# Altium schematic sheet PowerPath.SchDoc
size Tabloid
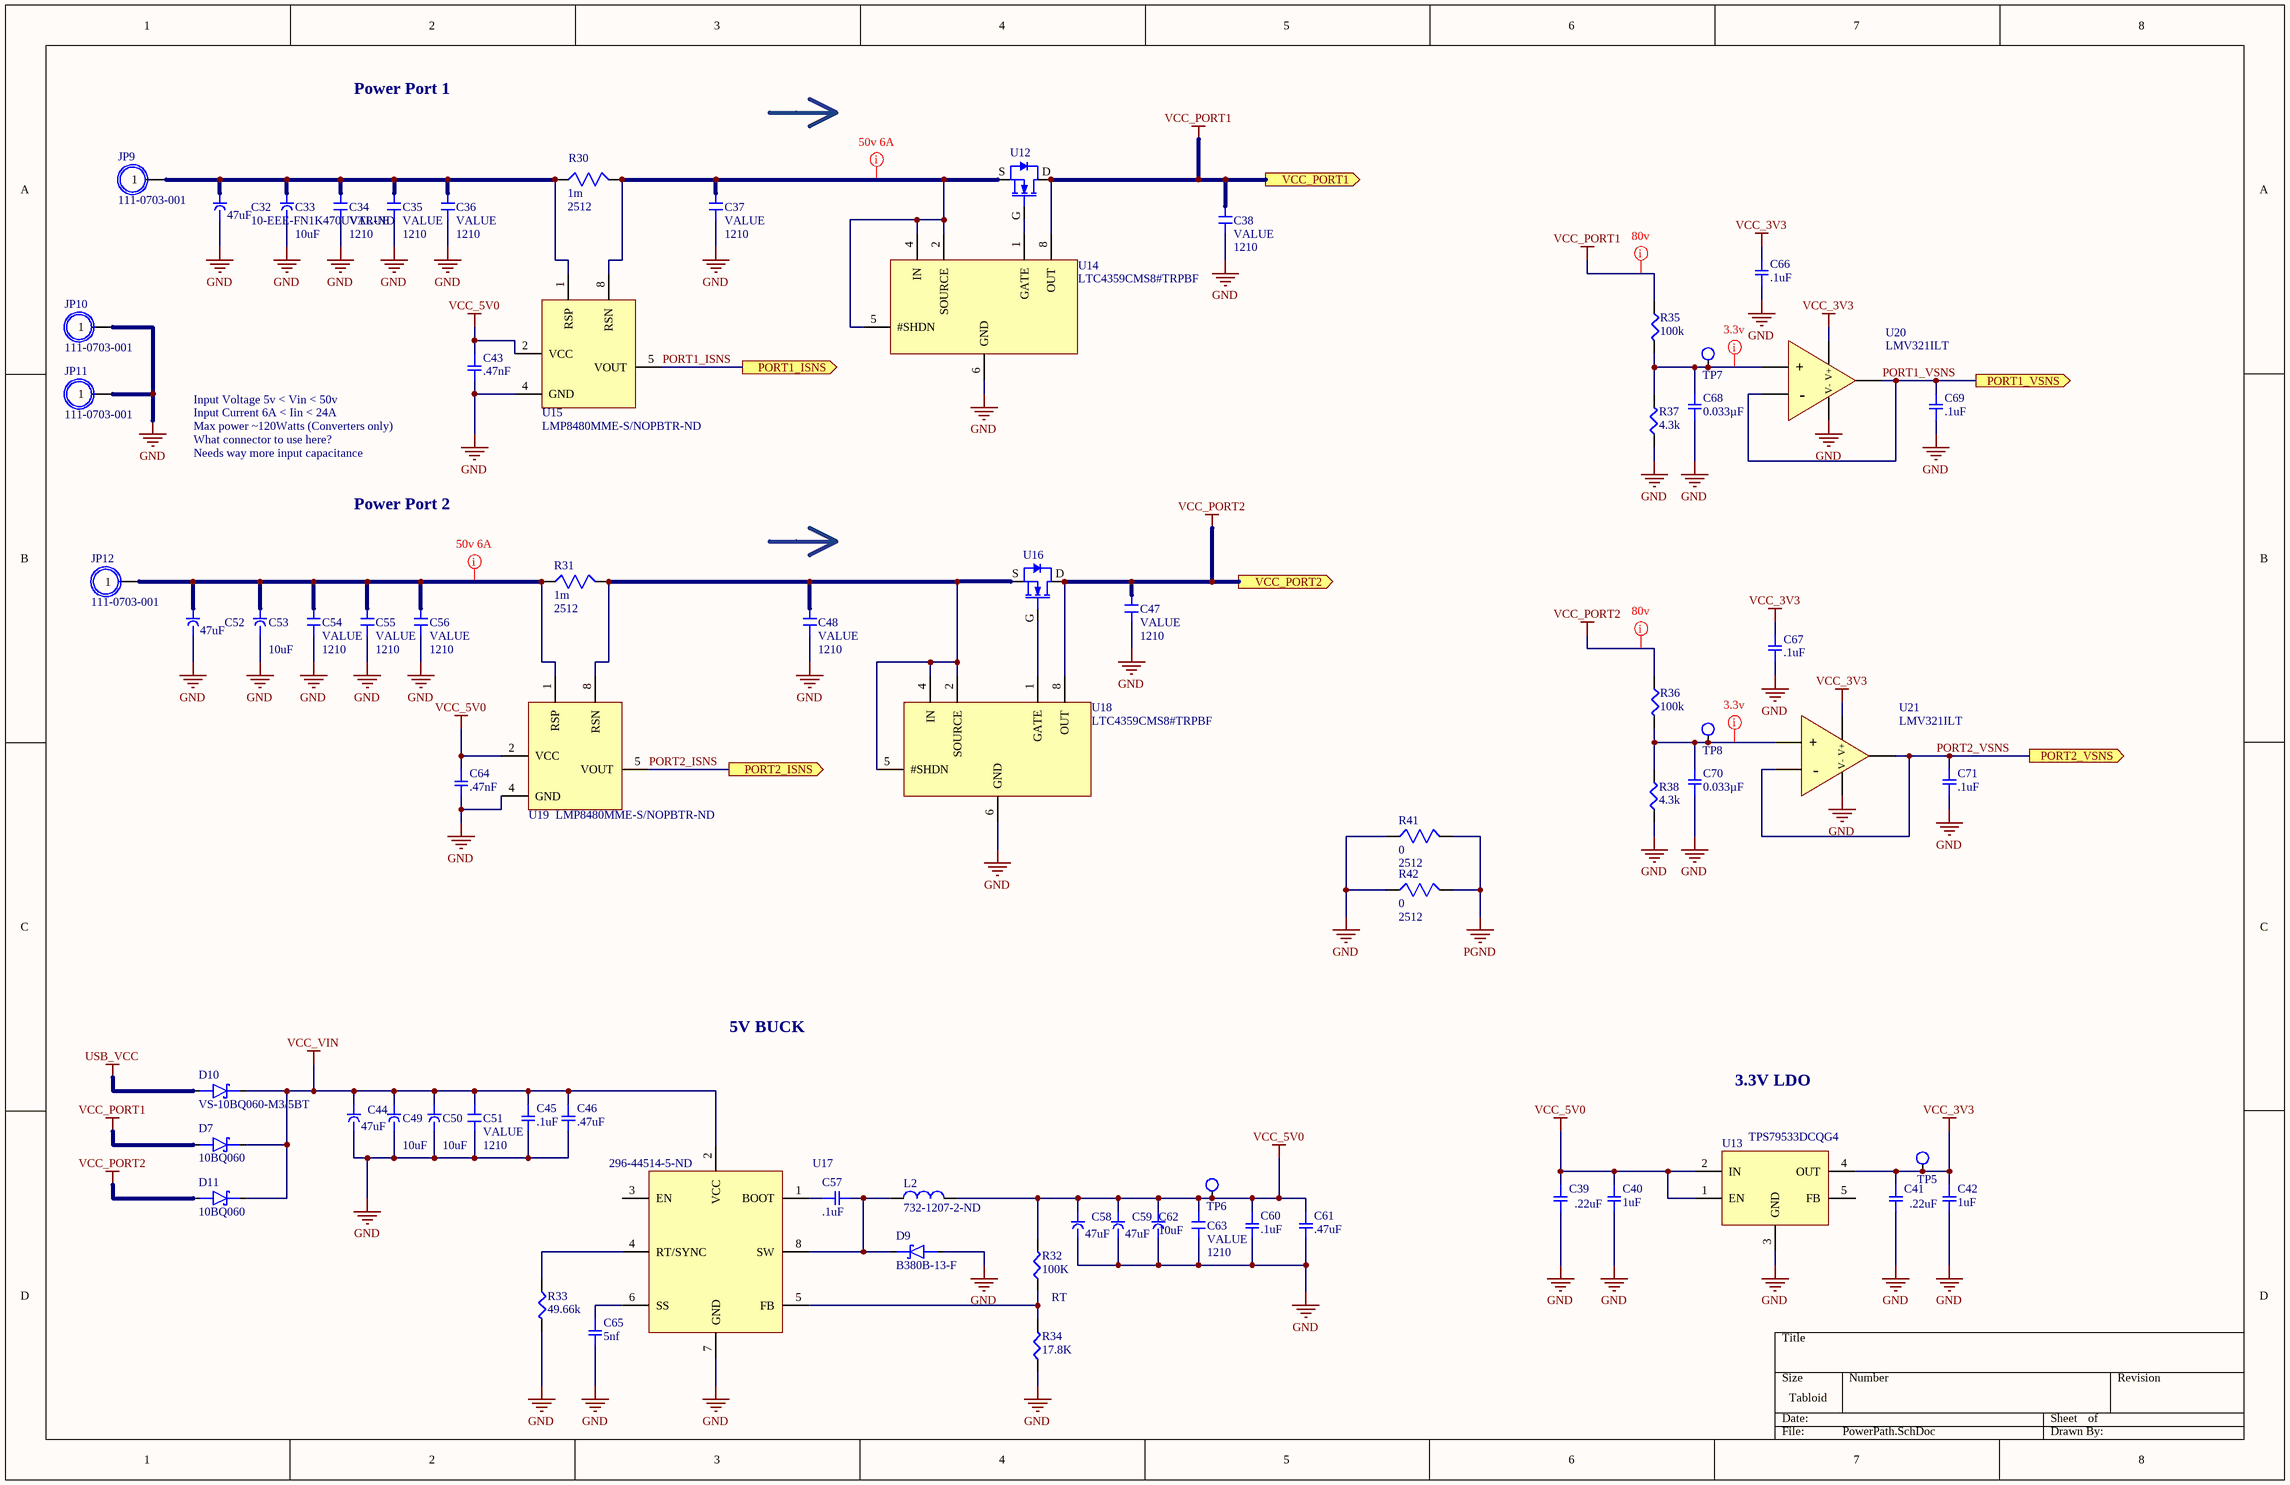
[diagram p0: PowerPath.SchDoc]

## Parts
C32  10-EEE-FN1K470UVTR-ND  [EEE-FN1K470UV]
C33  value 10uF  [panasonic d8]  (hidden comment: EEE-FN1K100XL)
C34  VALUE  Size: 1210  [1210 cap]
C35  VALUE  Size: 1210  [1210 cap]
C36  VALUE  Size: 1210  [1210 cap]
C37  VALUE  Size: 1210  [1210 cap]
C38  VALUE  Size: 1210  [1210 cap]
C39  .22uF  [SMD-0603C]
C40  1uF  [SMD-0603C]
C41  .22uF  [SMD-0603C]
C42  1uF  [SMD-0603C]
C43  .47nF  [SMD-0603C]
C44  10-EEE-FN1K470UVTR-ND  [EEE-FN1K470UV]  (value not drawn)
C45  .1uF  [SMD-0805C]
C46  .47uF  [SMD-0805C]
C47  VALUE  Size: 1210  [1210 cap]
C48  VALUE  Size: 1210  [1210 cap]
C49  value 10uF  [panasonic d8]  (hidden comment: EEE-FN1K100XL)
C50  value 10uF  [panasonic d8]  (hidden comment: EEE-FN1K100XL)
C51  VALUE  Size: 1210  [1210 cap]
C52  10-EEE-FN1K470UVTR-ND  [EEE-FN1K470UV]  (value not drawn)
C53  value 10uF  [panasonic d8]  (hidden comment: EEE-FN1K100XL)
C54  VALUE  Size: 1210  [1210 cap]
C55  VALUE  Size: 1210  [1210 cap]
C56  VALUE  Size: 1210  [1210 cap]
C57  .1uF  [SMD-0805C]
C58  10-EEE-FN1K470UVTR-ND  [EEE-FN1K470UV]  (value not drawn)
C59  10-EEE-FN1K470UVTR-ND  [EEE-FN1K470UV]  (value not drawn)
C60  .1uF  [SMD-0805C]
C61  .47uF  [SMD-0805C]
C62  value 10uF  [panasonic d8]  (hidden comment: EEE-FN1K100XL)
C63  VALUE  Size: 1210  [1210 cap]
C64  .47nF  [SMD-0603C]
C65  5nf  [SMD-0603C]
C66  .1uF  [SMD-0603C]
C67  .1uF  [SMD-0603C]
C68  0.033µF  [SMD-0603C]
C69  .1uF  [SMD-0603C]
C70  0.033µF  [SMD-0603C]
C71  .1uF  [SMD-0603C]
D7  10BQ060  [DO-214AA/SMB]
D9  B380B-13-F  [DO-214AA/SMB]
D10  VS-10BQ060-M3/5BT  [DO-214AA/SMB]
D11  10BQ060  [DO-214AA/SMB]
JP9  111-0703-001  [Banana Jack Post]
JP10  111-0703-001  [Banana Jack Post]
JP11  111-0703-001  [Banana Jack Post]
JP12  111-0703-001  [Banana Jack Post]
L2  732-1207-2-ND  [8R2]
R30  1m  [2512]
R31  1m  [2512]
R32  100K  [SMD-0603-RES]
R33  49.66k  [SMD-0603-RES]
R34  17.8K  [SMD-0603-RES]
R35  100k  [SMD-0805-RES]
R36  100k  [SMD-0805-RES]
R37  4.3k  [SMD-0603-RES]
R38  4.3k  [SMD-0603-RES]
R41  0  [2512]
R42  0  [2512]
TP5  TEST POINT 1MM  [TEST POINT]  (value not drawn)
TP6  TEST POINT 1MM  [TEST POINT]  (value not drawn)
TP7  TEST POINT 1MM  [TEST POINT]  (value not drawn)
TP8  TEST POINT 1MM  [TEST POINT]  (value not drawn)
U12  SQJA80EP-T1_GE3TR-ND  [PowerPAK® SO-8L SINGLE]  (value not drawn)
U13  TPS79533DCQG4  [6 pin sot223]
U14  LTC4359CMS8#TRPBF  [8-MSOP]
U15  LMP8480MME-S/NOPBTR-ND  [DGK(S-PDSO-G8)]
U16  SQJA80EP-T1_GE3TR-ND  [PowerPAK® SO-8L SINGLE]  (value not drawn)
U17  296-44514-5-ND  [DDA R-PDSO-G8]
U18  LTC4359CMS8#TRPBF  [8-MSOP]
U19  LMP8480MME-S/NOPBTR-ND  [DGK(S-PDSO-G8)]
U20  LMV321ILT  [SOT-23-5]
U21  LMV321ILT  [SOT-23-5]

## Ports
PORT1_ISNS (out), PORT1_VSNS (out), PORT2_ISNS (out), PORT2_VSNS (out), VCC_PORT1 (out), VCC_PORT2 (out)

## Nets
GND: C32.1 C33.2 C34.2 C35.2 C36.2 C37.2 C38.2 C39.2 C40.2 C41.2 C42.2 C43.2 C44.1 C45.2 C46.2 C47.2 C48.2 C49.2 C50.2 C51.2 C52.1 C53.2 C54.2 C55.2 C56.2 C58.1 C59.1 C60.2 C61.2 C62.2 C63.2 C64.2 C65.2 C66.1 C67.1 C68.1 C69.1 C70.1 C71.1 D9.2 JP10.1 JP11.1 R33.2 R34.1 R37.1 R38.1 R41.1 R42.1 U13.3(GND) U14.6(GND) U15.4(GND) U17.7(GND) U18.6(GND) U19.4(GND) U20.2(V-) U21.2(V-)
PGND: R41.2 R42.2
USB_VCC: D10.2
VCC_3V3: C41.1 C42.1 C66.2 C67.2 TP5.1 U13.4(OUT) U20.5(V+) U21.5(V+)
VCC_5V0: C39.1 C40.1 C43.1 C58.2 C59.2 C60.1 C61.1 C62.1 C63.1 C64.1 L2.2 R32.2 TP6.1 U13.1(EN) U13.2(IN) U15.2(VCC) U19.2(VCC)
VCC_PORT1: C38.1 D7.2 R35.1 U12.D(DRAIN) U14.8(OUT) ; port VCC_PORT1
VCC_PORT2: C47.1 D11.2 R36.1 U16.D(DRAIN) U18.8(OUT) ; port VCC_PORT2
VCC_VIN: C44.2 C45.1 C46.1 C49.1 C50.1 C51.1 D7.1 D10.1 D11.1 U17.2(VCC)
PORT1_ISNS: U15.5(VOUT) ; port PORT1_ISNS
PORT1_VSNS: C69.2 U20.3(-) U20.4(OUT) ; port PORT1_VSNS
PORT2_ISNS: U19.5(VOUT) ; port PORT2_ISNS
PORT2_VSNS: C71.2 U21.3(-) U21.4(OUT) ; port PORT2_VSNS
NetC32_2: C32.2 C33.1 C34.1 C35.1 C36.1 JP9.1 R30.1 U15.1(RSP)
NetC37_1: C37.1 R30.2 U12.S(SOURCE) U14.2(SOURCE) U14.4(IN) U14.5(#SHDN) U15.8(RSN)
NetC48_1: C48.1 R31.2 U16.S(SOURCE) U18.2(SOURCE) U18.4(IN) U18.5(#SHDN) U19.8(RSN)
NetC52_2: C52.2 C53.1 C54.1 C55.1 C56.1 JP12.1 R31.1 U19.1(RSP)
NetC57_1: C57.1 U17.1(BOOT)
NetC57_2: C57.2 D9.1 L2.1 U17.8(SW)
NetC65_1: C65.1 U17.6(SS)
NetC68_2: C68.2 R35.2 R37.2 TP7.1 U20.1(+)
NetC70_2: C70.2 R36.2 R38.2 TP8.1 U21.1(+)
NetR32_1: R32.1 R34.2 U17.5(FB)
NetR33_1: R33.1 U17.4(RT/SYNC)
NetU12_G: U12.G(GATE) U14.1(GATE)
NetU16_G: U16.G(GATE) U18.1(GATE)

Not connected (* = marked no-connect by the designer): U13 5(FB); U17 3(EN)

## Layout directives
mark named 50v 6A: NetC37_1, NetC52_2
mark named 80v: VCC_PORT1, VCC_PORT2
mark named 3.3v: NetC68_2, NetC70_2

## Notes on the sheet
- Power Port 1
- Input Voltage 5v < Vin < 50v
- Input Current 6A < Iin < 24A
- Max power ~120Watts (Converters only)
- What connector to use here?
- Needs way more input capacitance
- Power Port 2
- 5V BUCK
- 3.3V LDO
- RT
- (in symbol CAP ALUM 47UF) 47uF

## Library data of the parts
C32 C44 C52 C58 C59 = CAP ALUM 47UF: CAP ALUM 47UF 20% 80V SMD
C33 C49 C50 C53 C62 = CAP ALUM 10UF: CAP ALUM 10UF 20% 80V SMD
C34-C38 C47 C48 C51 C54-C56 C63 = CAP SMD 1210
C39-C42 = GCJ188R71E224KA12D: CAP CER 0.22UF 25V X7R 0603; Manufacturer: Murata Electronics North America; Factory Stock: 0; Unit Price (USD): 0.24; Minimum Quantity: 1; Value: 0.22µF; Tolerance: ±10%; Datasheets: http://www.murata.com/~/media/webrenewal/support/library/catalog/products/capacitor/mlcc/c03e.ashx; Image: //media.digikey.com/Renders/Murata%20Renders/0603%28LQG18%29.jpg; Digi-Key Part Number: 490-5797-1-ND; Part Number: GCJ188R71E224KA12D; Quantity Available: 23903; @ qty: 0; Packaging: Cut Tape (CT); Series: GCJ; Part Status: Active; Voltage: 25V; Temperature Coefficient: X7R; Operating Temperature: -55°C ~ 125°C; Features: Soft Termination; Ratings: AEC-Q200; Applications: Automotive, Boardflex Sensitive; Mounting Type: Surface Mount, MLCC; Package / Case: 0603 (1608 Metric); Size / Dimension: 0.063" L x 0.031" W (1.60mm x 0.80mm); Height - Seated (Max): -; Thickness (Max): 0.035" (0.90mm); Lead Spacing: -; Lead Style: -
C43 C64 = GCJ188R71H222KA01D: CAP CER 2200PF 50V X7R 0603; Manufacturer: Murata Electronics North America; Factory Stock: 0; Unit Price (USD): 0.16; Minimum Quantity: 1; Tolerance: ±10%; Datasheets: http://www.murata.com/~/media/webrenewal/support/library/catalog/products/capacitor/mlcc/c03e.ashx; Image: //media.digikey.com/Renders/Murata%20Renders/0603%28LQG18%29.jpg; Digi-Key Part Number: 490-5766-1-ND; Part Number: GCJ188R71H222KA01D; Quantity Available: 34786; @ qty: 0; Packaging: Cut Tape (CT); Series: GCJ; Part Status: Active; Value: 2200pF; Voltage: 50V; Temperature Coefficient: X7R; Operating Temperature: -55°C ~ 125°C; Features: Soft Termination; Ratings: AEC-Q200; Applications: Automotive, Boardflex Sensitive; Mounting Type: Surface Mount, MLCC; Package / Case: 0603 (1608 Metric); Size / Dimension: 0.063" L x 0.031" W (1.60mm x 0.80mm); Height - Seated (Max): -; Thickness (Max): 0.031" (0.80mm); Lead Spacing: -; Lead Style: -
C45 C46 C60 C61 = GRM2195C1H123FA01D: CAP CER 0.012UF 50V NP0 0805; Manufacturer: Murata Electronics North America; Factory Stock: 0; Unit Price (USD): 0.91; Minimum Quantity: 1; Value: 0.012µF; Tolerance: ±1%; Temperature Coefficient: C0G, NP0; Datasheets: http://www.murata.com/~/media/webrenewal/support/library/catalog/products/capacitor/mlcc/c02e.pdf; Image: //media.digikey.com/Renders/Murata%20Renders/0805%20(2012%20Metric)%20.85mm.jpg; Digi-Key Part Number: 490-12608-1-ND; Part Number: GRM2195C1H123FA01D; Quantity Available: 4905; @ qty: 0; Packaging: Cut Tape (CT); Series: GRM; Part Status: Active; Voltage: 50V; Operating Temperature: -55°C ~ 125°C; Features: -; Ratings: -; Applications: General Purpose; Mounting Type: Surface Mount, MLCC; Package / Case: 0805 (2012 Metric); Size / Dimension: 0.079" L x 0.049" W (2.00mm x 1.25mm); Height - Seated (Max): -; Thickness (Max): 0.037" (0.95mm); Lead Spacing: -; Lead Style: -
C57 = GRM2195C1H153GA01D: CAP CER 0.015UF 50V NP0 0805; Manufacturer: Murata Electronics North America; Factory Stock: 0; Unit Price (USD): 0.72; Minimum Quantity: 1; Value: 0.015µF; Tolerance: ±2%; Temperature Coefficient: C0G, NP0; Datasheets: http://www.murata.com/~/media/webrenewal/support/library/catalog/products/capacitor/mlcc/c02e.pdf; Image: //media.digikey.com/Renders/Murata%20Renders/0805%20(2012%20Metric)%20.85mm.jpg; Digi-Key Part Number: 490-11581-1-ND; Part Number: GRM2195C1H153GA01D; Quantity Available: 3423; @ qty: 0; Packaging: Cut Tape (CT); Series: GRM; Part Status: Active; Voltage: 50V; Operating Temperature: -55°C ~ 125°C; Features: -; Ratings: -; Applications: General Purpose; Mounting Type: Surface Mount, MLCC; Package / Case: 0805 (2012 Metric); Size / Dimension: 0.079" L x 0.049" W (2.00mm x 1.25mm); Height - Seated (Max): -; Thickness (Max): 0.037" (0.95mm); Lead Spacing: -; Lead Style: -
C65 = GCJ188R72A103KA01D: CAP CER 10000PF 100V X7R 0603; Manufacturer: Murata Electronics North America; Factory Stock: 0; Unit Price (USD): 0.21; Minimum Quantity: 1; Tolerance: ±10%; Datasheets: http://www.murata.com/~/media/webrenewal/support/library/catalog/products/capacitor/mlcc/c03e.ashx; Image: //media.digikey.com/Renders/Murata%20Renders/0603%28LQG18%29.jpg; Digi-Key Part Number: 490-5771-1-ND; Part Number: GCJ188R72A103KA01D; Quantity Available: 130287; @ qty: 0; Packaging: Cut Tape (CT); Series: GCJ; Part Status: Active; Value: 10000pF; Voltage: 100V; Temperature Coefficient: X7R; Operating Temperature: -55°C ~ 125°C; Features: Soft Termination; Ratings: AEC-Q200; Applications: Automotive, Boardflex Sensitive; Mounting Type: Surface Mount, MLCC; Package / Case: 0603 (1608 Metric); Size / Dimension: 0.063" L x 0.031" W (1.60mm x 0.80mm); Height - Seated (Max): -; Thickness (Max): 0.031" (0.80mm); Lead Spacing: -; Lead Style: -
C66 C67 C69 C71 = GCJ188R71H333KA12D: CAP CER 0.033UF 50V X7R 0603; Manufacturer: Murata Electronics North America; Factory Stock: 0; Unit Price (USD): 0.23; Minimum Quantity: 1; Value: 0.033µF; Tolerance: ±10%; Datasheets: http://www.murata.com/~/media/webrenewal/support/library/catalog/products/capacitor/mlcc/c03e.ashx; Image: //media.digikey.com/Renders/Murata%20Renders/0603%28LQG18%29.jpg; Digi-Key Part Number: 490-5852-1-ND; Part Number: GCJ188R71H333KA12D; Quantity Available: 16459; @ qty: 0; Packaging: Cut Tape (CT); Series: GCJ; Part Status: Active; Voltage: 50V; Temperature Coefficient: X7R; Operating Temperature: -55°C ~ 125°C; Features: Soft Termination; Ratings: AEC-Q200; Applications: Automotive, Boardflex Sensitive; Mounting Type: Surface Mount, MLCC; Package / Case: 0603 (1608 Metric); Size / Dimension: 0.063" L x 0.031" W (1.60mm x 0.80mm); Height - Seated (Max): -; Thickness (Max): 0.031" (0.80mm); Lead Spacing: -; Lead Style: -
C68 C70 = GCJ188R71H333KA12D: CAP CER 0.033UF 50V X7R 0603; Manufacturer: Murata Electronics North America; Factory Stock: 0; Unit Price (USD): 0.23; Minimum Quantity: 1; Tolerance: ±10%; Datasheets: http://www.murata.com/~/media/webrenewal/support/library/catalog/products/capacitor/mlcc/c03e.ashx; Image: //media.digikey.com/Renders/Murata%20Renders/0603%28LQG18%29.jpg; Digi-Key Part Number: 490-5852-1-ND; Part Number: GCJ188R71H333KA12D; Quantity Available: 16459; @ qty: 0; Packaging: Cut Tape (CT); Series: GCJ; Part Status: Active; Value: 0.033µF; Voltage: 50V; Temperature Coefficient: X7R; Operating Temperature: -55°C ~ 125°C; Features: Soft Termination; Ratings: AEC-Q200; Applications: Automotive, Boardflex Sensitive; Mounting Type: Surface Mount, MLCC; Package / Case: 0603 (1608 Metric); Size / Dimension: 0.063" L x 0.031" W (1.60mm x 0.80mm); Height - Seated (Max): -; Thickness (Max): 0.031" (0.80mm); Lead Spacing: -; Lead Style: -
D7 D11 = DIODE 10BQ060: DIODE SCHOTTKY 60V 1A SMB / Diode Schottky 60 V 1A Surface Mount DO-214AA (SMB) / https://assets.nexperia.com/documents/package-information/SOT669.pdf
D9 = DIODE B380B-13-F: DIODE SCHOTTKY 80V 3A SMB
D10 = DIODE 10BQ060: DIODE SCHOTTKY 60V 1A SMB
JP9-JP12 = CONN BANANA JACK: CONN BIND POST KNURLED BLACK‎
L2 = INDUCTOR 744771008: FIXED IND 8.2UH 6.25A 20MOHM SMD
R30 R31 R41 R42 = RES SMD 2512: RES SMD 2512 2W; Size: 2512
R32-R34 = ERJ-3BQFR22V: RES SMD 0.22 OHM 1% 1/4W 0603; Manufacturer: Panasonic Electronic Components; Factory Stock: 0; Unit Price (USD): 0.05386; @ qty: 1500; Minimum Quantity: 1; Value: 0.22; Power (Watts): 0.25W, 1/4W; Temperature Coefficient: ±300ppm/°C; Part Number: ERJ-3BQFR22V; Datasheets: https://industrial.panasonic.com/cdbs/www-data/pdf/RDA0000/AOA0000C239.pdf; Image: //media.digikey.com/Photos/Panasonic%20Photos/MFG_ERJ-P6W%20Series.jpg; Digi-Key Part Number: P17245CT-ND; Quantity Available: 11618; Packaging: Cut Tape (CT); Series: ERJ; Part Status: Active; Tolerance: ±1%; Composition: Thick Film; Features: Automotive AEC-Q200, Current Sense; Operating Temperature: -55°C ~ 125°C; Package / Case: 0603 (1608 Metric); Supplier Device Package: 0603; Size / Dimension: 0.063" L x 0.031" W (1.60mm x 0.80mm); Height - Seated (Max): 0.022" (0.55mm); Number of Terminations: 2; Failure Rate: -
R35 R36 = ERJ-6CWFR011V: RES SMD 0.011 OHM 1% 1/2W 0805; Manufacturer: Panasonic Electronic Components; Factory Stock: 0; Unit Price (USD): 0.17178; @ qty: 1500; Minimum Quantity: 1; Value: 0.011; Power (Watts): 0.5W, 1/2W; Temperature Coefficient: ±75ppm/°C; Part Number: ERJ-6CWFR011V; Datasheets: https://industrial.panasonic.com/cdbs/www-data/pdf/RDA0000/AOA0000C239.pdf; Image: //media.digikey.com/Renders/Panasonic%20Renders/ERJ-0805%20Pkg.jpg; Digi-Key Part Number: P19197CT-ND; Quantity Available: 4985; Packaging: Cut Tape (CT); Series: ERJ; Part Status: Active; Tolerance: ±1%; Composition: Thick Film; Features: Automotive AEC-Q200, Current Sense; Operating Temperature: -55°C ~ 125°C; Package / Case: 0805 (2012 Metric); Supplier Device Package: 0805; Size / Dimension: 0.081" L x 0.051" W (2.05mm x 1.30mm); Height - Seated (Max): 0.030" (0.75mm); Number of Terminations: 2; Failure Rate: -
R37 R38 = ERJ-3BQF2R0V: RES SMD 2 OHM 1% 1/4W 0603; Manufacturer: Panasonic Electronic Components; Factory Stock: 0; Unit Price (USD): 0.05386; @ qty: 1500; Minimum Quantity: 1; Value: 2; Power (Watts): 0.25W, 1/4W; Temperature Coefficient: ±200ppm/°C; Part Number: ERJ-3BQF2R0V; Datasheets: https://industrial.panasonic.com/cdbs/www-data/pdf/RDA0000/AOA0000C239.pdf; Image: //media.digikey.com/Photos/Panasonic%20Photos/MFG_ERJ-P6W%20Series.jpg; Digi-Key Part Number: P17377CT-ND; Quantity Available: 221; Packaging: Cut Tape (CT); Series: ERJ; Part Status: Active; Tolerance: ±1%; Composition: Thick Film; Features: Automotive AEC-Q200, Current Sense; Operating Temperature: -55°C ~ 125°C; Package / Case: 0603 (1608 Metric); Supplier Device Package: 0603; Size / Dimension: 0.063" L x 0.031" W (1.60mm x 0.80mm); Height - Seated (Max): 0.022" (0.55mm); Number of Terminations: 2; Failure Rate: -
TP5-TP8 = TEST POINT 1MM: 1mm pad for test points
U12 U16 = FET SQJA80EP-T1_GE3: MOSFET N-CH 80V 60A PPAK SO-8
U13 = IC REG TPS79533DCQG4: IC REG LIN 3.3V 500MA SOT223-6
U14 U18 = IC LTC4359: OR Controller N+1 ORing Controller N-Channel N:1 8-MSOP
U15 U19 = IC LMP8480: IC CURR SENSE 1 CIRCUIT 8VSSOP
U17 = IC LMR16030SDDA: IC REG BUCK ADJUSTABLE 3A 8SOPWR
U20 U21 = IC OPAMP GP 1 CIRCUIT: IC OPAMP GP 1 CIRCUIT SOT23-5